# Altium schematic sheet pyboardCN_V2.SchDoc
size A4
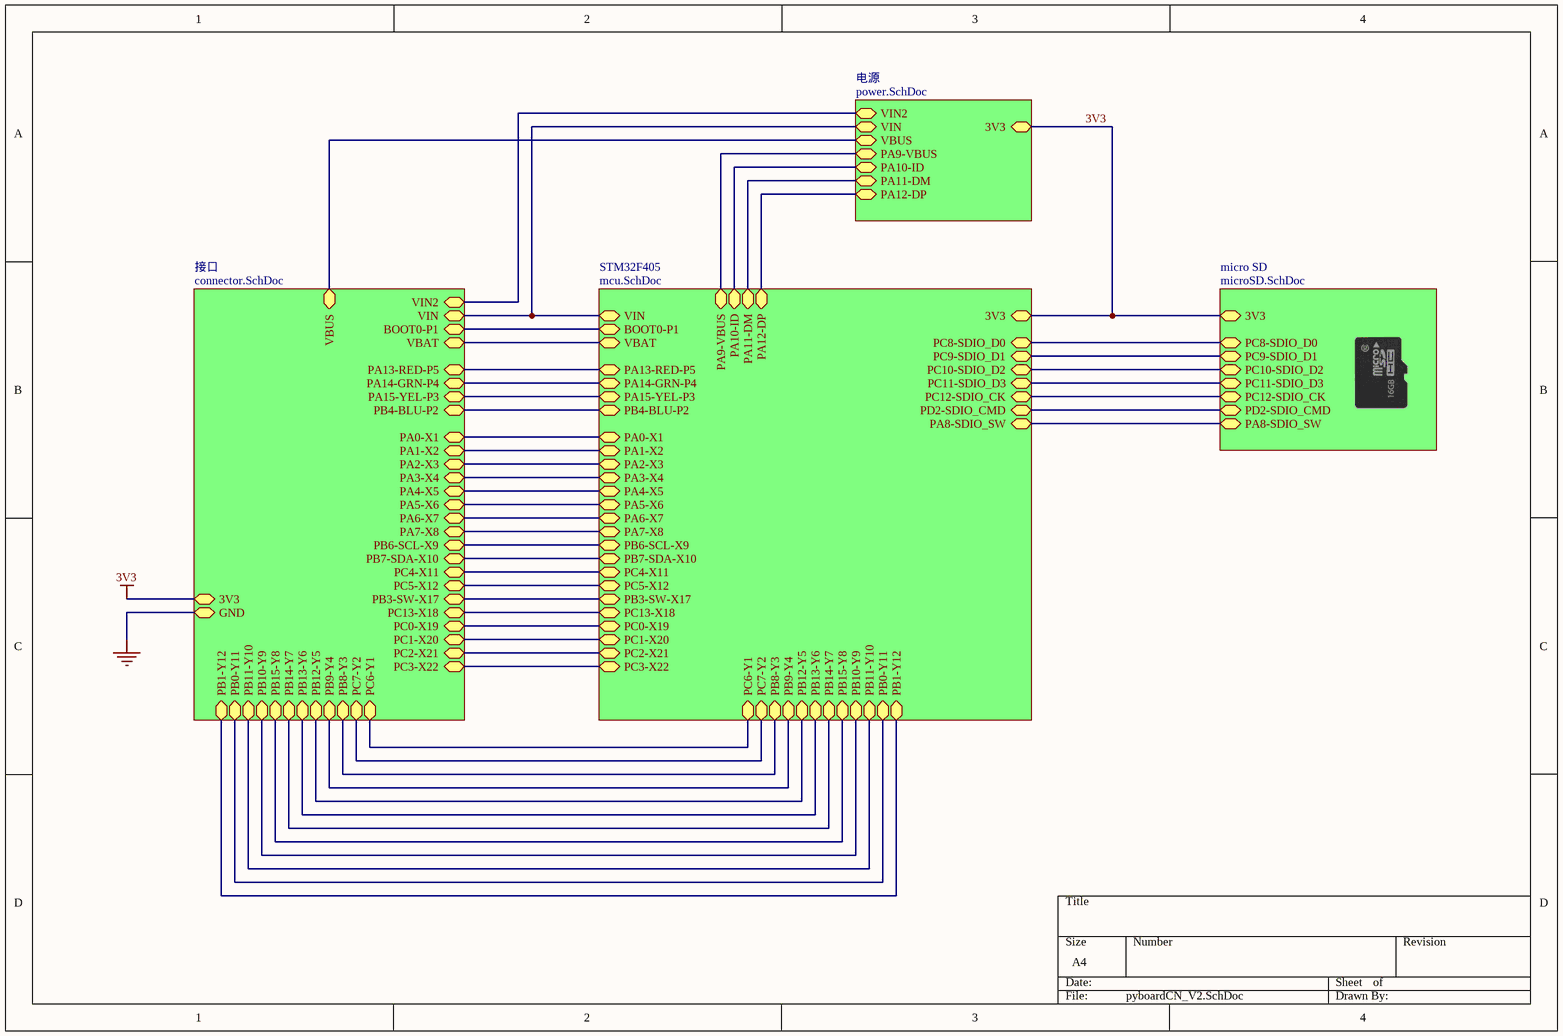
[diagram p0: pyboardCN_V2.SchDoc]

## Sub-sheets
micro SD = microSD.SchDoc: PC8-SDIO_D0, PC9-SDIO_D1, PC10-SDIO_D2, PC11-SDIO_D3, PC12-SDIO_CK, PD2-SDIO_CMD, PA8-SDIO_SW, 3V3
STM32F405 = mcu.SchDoc: PC8-SDIO_D0, PC9-SDIO_D1, PC10-SDIO_D2, PC11-SDIO_D3, PC12-SDIO_CK, PD2-SDIO_CMD, PA8-SDIO_SW, VIN, PA9-VBUS, PA10-ID, PA11-DM, PA12-DP, PA0-X1, PA1-X2, PA2-X3, PA3-X4, PA4-X5, PA5-X6, PA6-X7, PA7-X8, PB6-SCL-X9, PB7-SDA-X10, PC5-X12, PC4-X11, PB3-SW-X17, PC13-X18, PC0-X19, PC1-X20, PC2-X21, PC3-X22, PC6-Y1, PC7-Y2, PB8-Y3, PB9-Y4, PB12-Y5, PB13-Y6, PB14-Y7, PB15-Y8, PB10-Y9, PB11-Y10, PB0-Y11, PB1-Y12, BOOT0-P1, VBAT, PA13-RED-P5, PA14-GRN-P4, PA15-YEL-P3, PB4-BLU-P2, 3V3
接口 = connector.SchDoc: VIN, PC6-Y1, PC7-Y2, PB8-Y3, PB9-Y4, PB12-Y5, PB13-Y6, PB14-Y7, PB15-Y8, PB10-Y9, PB11-Y10, PB0-Y11, PB1-Y12, PA0-X1, PA1-X2, PA2-X3, PA3-X4, PA4-X5, PA5-X6, PA6-X7, PA7-X8, PB6-SCL-X9, PB7-SDA-X10, PC5-X12, PC4-X11, PB3-SW-X17, PC13-X18, PC0-X19, PC1-X20, PC2-X21, PC3-X22, BOOT0-P1, VBAT, PA13-RED-P5, PA14-GRN-P4, PA15-YEL-P3, PB4-BLU-P2, VIN2, 3V3, GND, VBUS
电源 = power.SchDoc: VIN, PA9-VBUS, PA10-ID, PA11-DM, PA12-DP, 3V3, VIN2, VBUS

## Nets
3V3: sheet STM32F405/3V3, sheet 接口/3V3, sheet 电源/3V3, sheet micro SD/3V3
GND: sheet 接口/GND
(unnamed): sheet STM32F405/PC8-SDIO_D0, sheet micro SD/PC8-SDIO_D0
(unnamed): sheet STM32F405/PC9-SDIO_D1, sheet micro SD/PC9-SDIO_D1
(unnamed): sheet STM32F405/PC10-SDIO_D2, sheet micro SD/PC10-SDIO_D2
(unnamed): sheet STM32F405/PC11-SDIO_D3, sheet micro SD/PC11-SDIO_D3
(unnamed): sheet STM32F405/PC12-SDIO_CK, sheet micro SD/PC12-SDIO_CK
(unnamed): sheet STM32F405/PD2-SDIO_CMD, sheet micro SD/PD2-SDIO_CMD
(unnamed): sheet STM32F405/PA8-SDIO_SW, sheet micro SD/PA8-SDIO_SW
(unnamed): sheet STM32F405/VIN, sheet 接口/VIN, sheet 电源/VIN
(unnamed): sheet STM32F405/PA9-VBUS, sheet 电源/PA9-VBUS
(unnamed): sheet STM32F405/PA10-ID, sheet 电源/PA10-ID
(unnamed): sheet STM32F405/PA11-DM, sheet 电源/PA11-DM
(unnamed): sheet STM32F405/PA12-DP, sheet 电源/PA12-DP
(unnamed): sheet STM32F405/PA0-X1, sheet 接口/PA0-X1
(unnamed): sheet STM32F405/PA1-X2, sheet 接口/PA1-X2
(unnamed): sheet STM32F405/PA2-X3, sheet 接口/PA2-X3
(unnamed): sheet STM32F405/PA3-X4, sheet 接口/PA3-X4
(unnamed): sheet STM32F405/PA4-X5, sheet 接口/PA4-X5
(unnamed): sheet STM32F405/PA5-X6, sheet 接口/PA5-X6
(unnamed): sheet STM32F405/PA6-X7, sheet 接口/PA6-X7
(unnamed): sheet STM32F405/PA7-X8, sheet 接口/PA7-X8
(unnamed): sheet STM32F405/PB6-SCL-X9, sheet 接口/PB6-SCL-X9
(unnamed): sheet STM32F405/PB7-SDA-X10, sheet 接口/PB7-SDA-X10
(unnamed): sheet STM32F405/PC5-X12, sheet 接口/PC5-X12
(unnamed): sheet STM32F405/PC4-X11, sheet 接口/PC4-X11
(unnamed): sheet STM32F405/PB3-SW-X17, sheet 接口/PB3-SW-X17
(unnamed): sheet STM32F405/PC13-X18, sheet 接口/PC13-X18
(unnamed): sheet STM32F405/PC0-X19, sheet 接口/PC0-X19
(unnamed): sheet STM32F405/PC1-X20, sheet 接口/PC1-X20
(unnamed): sheet STM32F405/PC2-X21, sheet 接口/PC2-X21
(unnamed): sheet STM32F405/PC3-X22, sheet 接口/PC3-X22
(unnamed): sheet STM32F405/PC6-Y1, sheet 接口/PC6-Y1
(unnamed): sheet STM32F405/PC7-Y2, sheet 接口/PC7-Y2
(unnamed): sheet STM32F405/PB8-Y3, sheet 接口/PB8-Y3
(unnamed): sheet STM32F405/PB9-Y4, sheet 接口/PB9-Y4
(unnamed): sheet STM32F405/PB12-Y5, sheet 接口/PB12-Y5
(unnamed): sheet STM32F405/PB13-Y6, sheet 接口/PB13-Y6
(unnamed): sheet STM32F405/PB14-Y7, sheet 接口/PB14-Y7
(unnamed): sheet STM32F405/PB15-Y8, sheet 接口/PB15-Y8
(unnamed): sheet STM32F405/PB10-Y9, sheet 接口/PB10-Y9
(unnamed): sheet STM32F405/PB11-Y10, sheet 接口/PB11-Y10
(unnamed): sheet STM32F405/PB0-Y11, sheet 接口/PB0-Y11
(unnamed): sheet STM32F405/PB1-Y12, sheet 接口/PB1-Y12
(unnamed): sheet STM32F405/BOOT0-P1, sheet 接口/BOOT0-P1
(unnamed): sheet STM32F405/VBAT, sheet 接口/VBAT
(unnamed): sheet STM32F405/PA13-RED-P5, sheet 接口/PA13-RED-P5
(unnamed): sheet STM32F405/PA14-GRN-P4, sheet 接口/PA14-GRN-P4
(unnamed): sheet STM32F405/PA15-YEL-P3, sheet 接口/PA15-YEL-P3
(unnamed): sheet STM32F405/PB4-BLU-P2, sheet 接口/PB4-BLU-P2
(unnamed): sheet 接口/VIN2, sheet 电源/VIN2
(unnamed): sheet 接口/VBUS, sheet 电源/VBUS